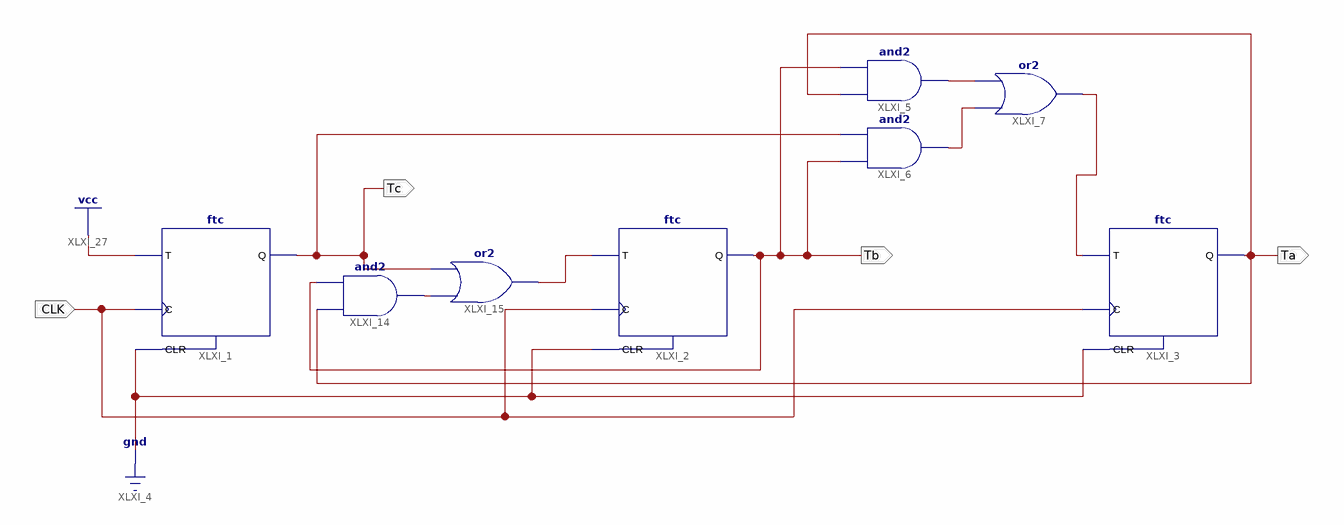
[diagram p0: schematic sheet 1]
// Xilinx ISE schematic main.sch (spartan6) as structural Verilog: 8 symbols, 4 ports
module main (
  input  CLK,
  output Ta,
  output Tb,
  output Tc
);

  wire XLXN_7, XLXN_8, XLXN_39, XLXN_44, XLXN_46;

  ftc XLXI_1 (.C(CLK), .CLR(1'b0), .T(1'b1), .Q(Tc));
  ftc XLXI_2 (.C(CLK), .CLR(1'b0), .T(XLXN_44), .Q(Tb));
  ftc XLXI_3 (.C(CLK), .CLR(1'b0), .T(XLXN_46), .Q(Ta));
  or XLXI_15 (XLXN_44, XLXN_39, Tc);
  and XLXI_14 (XLXN_39, Ta, Tb);
  and XLXI_5 (XLXN_8, Ta, Tb);
  and XLXI_6 (XLXN_7, Tb, Tc);
  or XLXI_7 (XLXN_46, XLXN_7, XLXN_8);
endmodule
